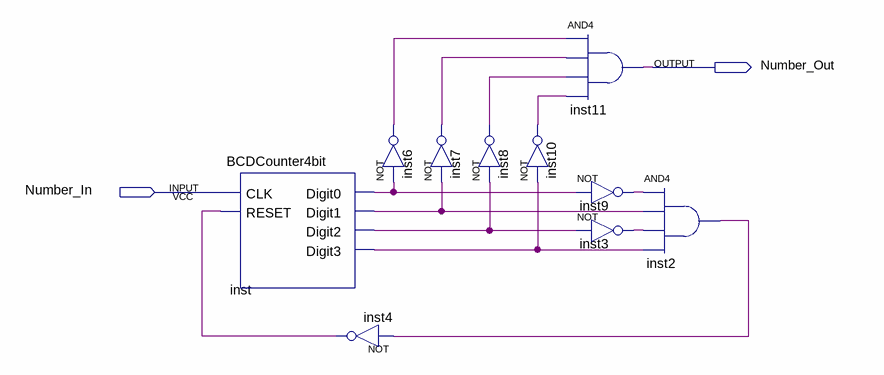
[diagram p0: schematic sheet]
// Quartus schematic divideBy10.bdf as structural Verilog: 10 symbols, 2 pins
module divideBy10 (
  input  Number_In,
  output Number_Out
);

  wire inst2_out, inst3_out, inst4_out, inst6_out, inst7_out, inst8_out, inst9_out, inst10_out, inst_digit0,
       inst_digit1, inst_digit2, inst_digit3;

  BCDCounter4bit inst (
    .CLK(Number_In), .RESET(inst4_out), .Digit0(inst_digit0), .Digit1(inst_digit1), .Digit2(inst_digit2),
    .Digit3(inst_digit3));
  not inst6 (inst6_out, inst_digit0);
  not inst4 (inst4_out, inst2_out);
  not inst7 (inst7_out, inst_digit1);
  not inst8 (inst8_out, inst_digit2);
  not inst10 (inst10_out, inst_digit3);
  and inst11 (Number_Out, inst6_out, inst7_out, inst8_out, inst10_out);
  not inst9 (inst9_out, inst_digit0);
  not inst3 (inst3_out, inst_digit2);
  and inst2 (inst2_out, inst9_out, inst_digit1, inst3_out, inst_digit3);
endmodule
